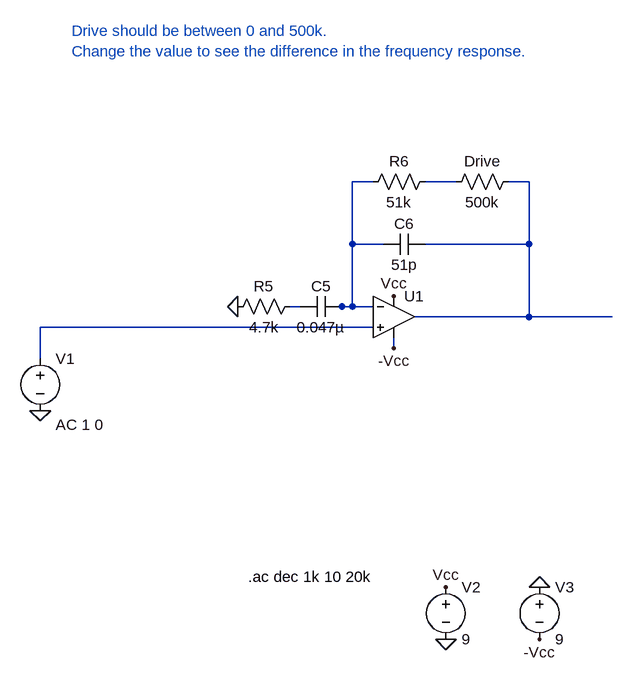
[diagram p0: schematic op_amp.asc]
op_amp.asc, the LTspice schematic file:
Version 4
SHEET 1 3044 724
WIRE 528 -400 496 -400
WIRE 656 -400 608 -400
WIRE 768 -400 736 -400
WIRE 496 -304 496 -400
WIRE 544 -304 496 -304
WIRE 768 -304 768 -400
WIRE 768 -304 608 -304
WIRE 416 -208 400 -208
WIRE 480 -208 464 -208
WIRE 496 -208 496 -304
WIRE 496 -208 480 -208
WIRE 528 -208 496 -208
WIRE 768 -192 768 -304
WIRE 768 -192 592 -192
WIRE 896 -192 768 -192
WIRE 528 -176 16 -176
WIRE 560 -144 560 -160
WIRE 16 -128 16 -176
FLAG 640 304 0
FLAG 784 224 0
FLAG 640 224 Vcc
FLAG 784 304 -Vcc
FLAG 560 -144 -Vcc
FLAG 560 -224 Vcc
FLAG 16 -48 0
FLAG 320 -208 0
SYMBOL voltage 640 208 R0
SYMATTR InstName V2
SYMATTR Value 9
SYMBOL voltage 784 208 R0
SYMATTR InstName V3
SYMATTR Value 9
SYMBOL OpAmps/UniversalOpAmp 560 -192 R0
SYMATTR InstName U1
SYMBOL voltage 16 -144 R0
WINDOW 123 24 118 Left 2
SYMATTR Value2 AC 1 0
SYMATTR InstName V1
SYMATTR Value ""
SYMBOL res 304 -192 R270
WINDOW 0 32 56 VTop 2
WINDOW 3 0 56 VBottom 2
SYMATTR InstName R5
SYMATTR Value 4.7k
SYMBOL cap 480 -224 R90
WINDOW 0 0 32 VBottom 2
WINDOW 3 32 32 VTop 2
SYMATTR InstName C5
SYMATTR Value 0.047µ
SYMBOL cap 608 -320 R90
WINDOW 0 0 32 VBottom 2
WINDOW 3 32 32 VTop 2
SYMATTR InstName C6
SYMATTR Value 51p
SYMBOL res 624 -416 R90
WINDOW 0 0 56 VBottom 2
WINDOW 3 32 56 VTop 2
SYMATTR InstName R6
SYMATTR Value 51k
SYMBOL res 752 -416 R90
WINDOW 0 0 56 VBottom 2
WINDOW 3 32 56 VTop 2
SYMATTR InstName Drive
SYMATTR Value 500k
TEXT 336 208 Left 2 !.ac dec 1k 10 20k
TEXT 64 -632 Left 2 ;Drive should be between 0 and 500k.\nChange the value to see the difference in the frequency response.

The netlist it stands for:
* op_amp.asc
V2 Vcc 0 9
V3 0 -Vcc 9
XU1 N005 N001 Vcc -Vcc N003 level1 Avol=1Meg GBW=10Meg Vos=0 En=0 Enk=0 In=0 Ink=0 Rin=500Meg  ; pins In+ In- V+ V- OUT
V1 N005 0 AC 1 0
R5 0 N004 4.7k
C5 N001 N004 0.047µ
C6 N003 N001 51p
R6 N002 N001 51k
R§Drive N003 N002 500k
.ac dec 1k 10 20k
* Drive should be between 0 and 500k.
* Change the value to see the difference in the frequency response.
.lib UniversalOpAmp1.lib
.backanno
.end